# EAGLE design M5_STACK_STAMP_C3_ISOBUS_JSTex (EAGLE 9.6.2)
Assembly variants: Inline
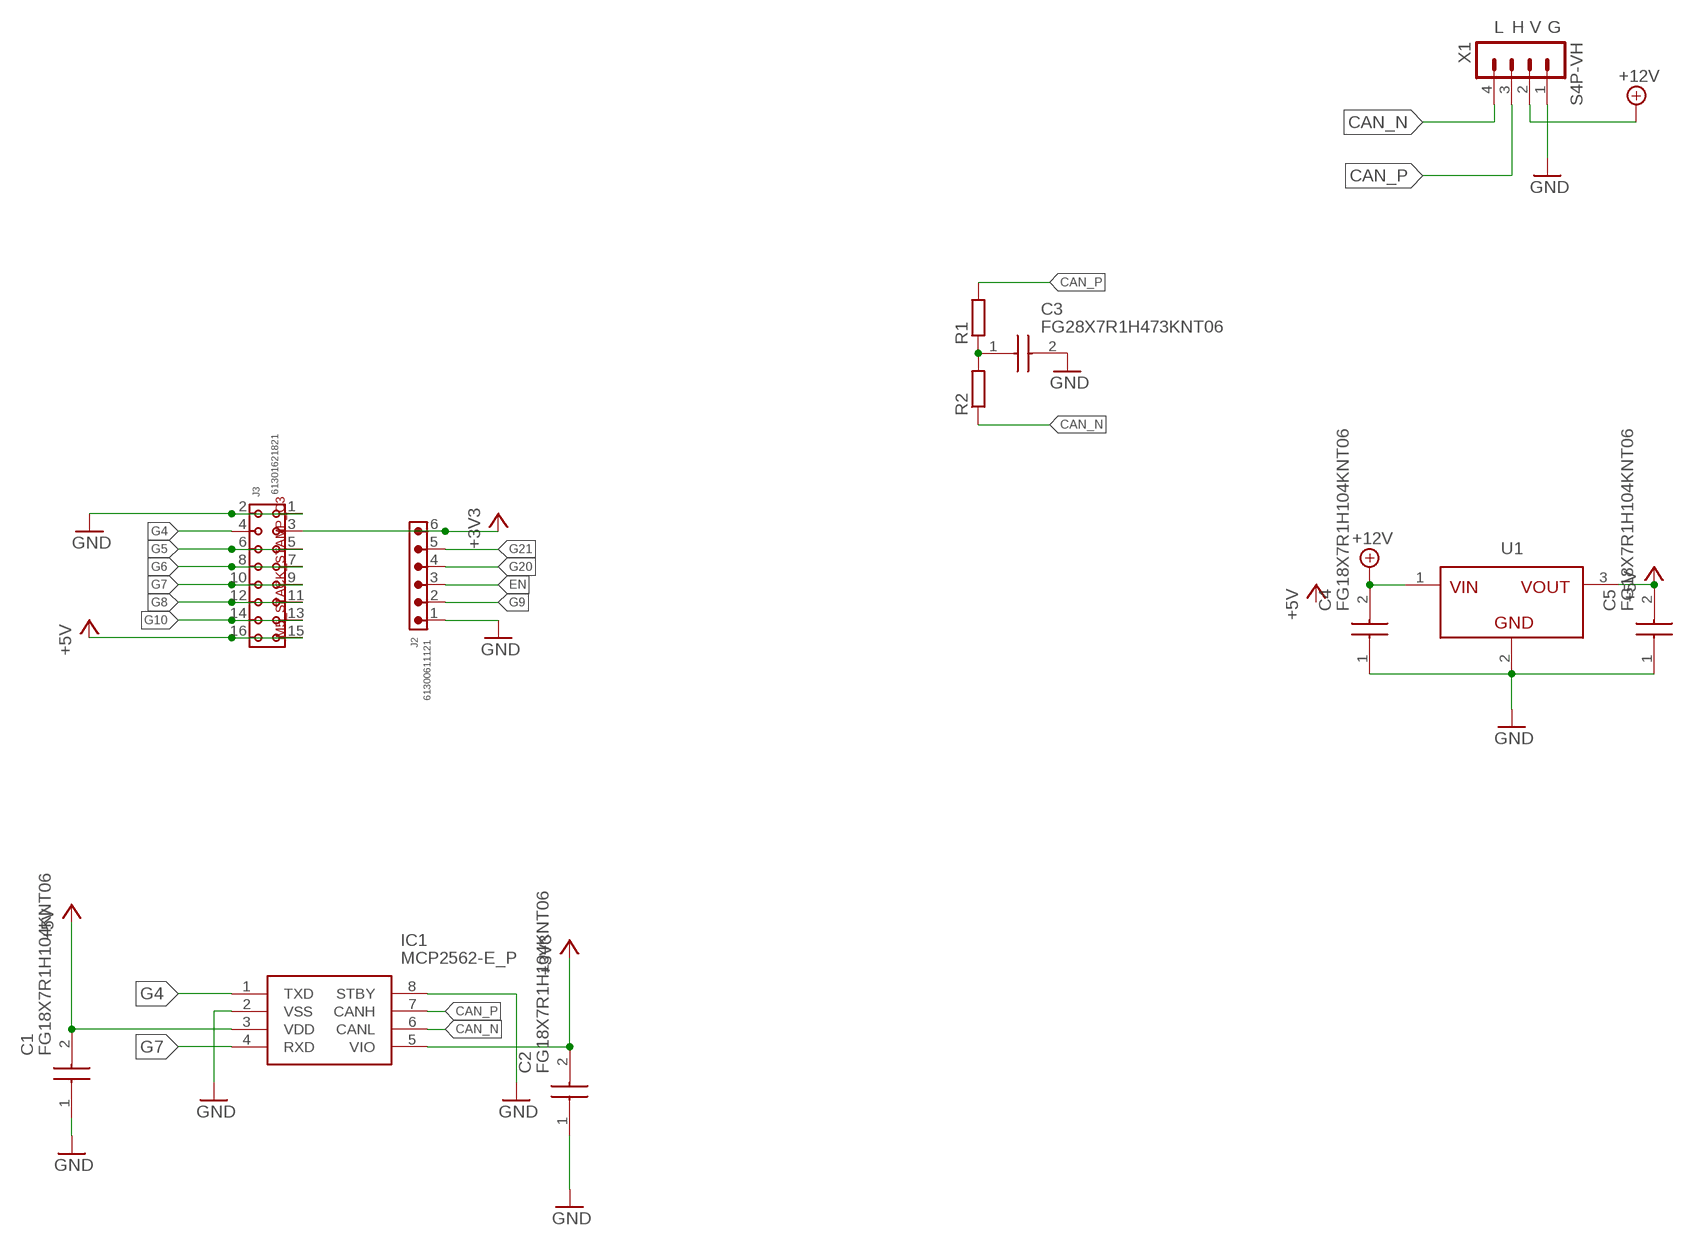
[diagram p0: schematic, sheet 1]

## Parts
C1  FG18X7R1H104KNT06  [FG18C0G1H101JNT06]
C2  FG18X7R1H104KNT06  [FG18C0G1H101JNT06]
C3  FG28X7R1H473KNT06  [FG28]
C4  FG18X7R1H104KNT06  [FG18C0G1H101JNT06]
C5  FG18X7R1H104KNT06  [FG18C0G1H101JNT06]
IC1  MCP2562-E_P  [DIP781W56P254L950H533Q8N]
J2  61300611121  6130XX11121_61300611121  [61300611121]
J3  61301621821  6130XX21821_61301621821  [61301621821]
R1  R-EU_0204/7  [0204/7]
R2  R-EU_0204/7  [0204/7]
U1  MAGI³C-FDSM_SIP-3_173010542_173XXXX42  [MAGI³C-FDSM_173XXXX42]
U$1  M5_STACK_STAMP_C3  [M5_STACK_STAMP_C3]
X1  S4P-VH  [S4P-VH]

## Nets
+3V3: C2.2 IC1.5(VIO) J2.6 J3.3
+5V: C1.2 C5.2 IC1.3(VDD) J3.15 J3.16 U1.3(VOUT)
+12V: C4.2 U1.1(VIN) X1.2
CAN_N: IC1.6(CANL) R2.1 X1.4
CAN_P: IC1.7(CANH) R1.2 X1.3
EN: J2.3
G4: IC1.1(TXD) J3.4
G5: J3.5 J3.6
G6: J3.7 J3.8
G7: IC1.4(RXD) J3.9 J3.10
G8: J3.11 J3.12
G9: J2.2
G10: J3.13 J3.14
G20: J2.4
G21: J2.5
GND: C1.1 C2.1 C3.2 C4.1 C5.1 IC1.2(VSS) IC1.8(STBY) J2.1 J3.1 J3.2 U1.2(GND) X1.1
N$1: C3.1 R1.1 R2.2

## Notes on the sheet
- L | H | V | G

## Library data of the parts
C1 C2 C4 C5 = FG18X7R1H104KNT06-pcb-part-libraries:FG18X7R1H104KNT06: Multilayer Ceramic Capacitors MLCC - Leaded RAD 50V 0.1uF X7R 10% LS:2.5mm Source: Datasheet <https://product.tdk.com/en/system/files?file=dam/doc/product/capacitor/ceramic/lead-mlcc/catalog/leadmlcc_halogenfree_fg_en.pdf>; DESCRIPTION: Multilayer Ceramic Capacitors MLCC - Leaded RAD 50V 0.1uF X7R 10% LS:2.5mm; HEIGHT: 5.5mm; MANUFACTURER_NAME: TDK; MANUFACTURER_PART_NUMBER: FG18X7R1H104KNT06; MOUSER_PART_NUMBER: 810-FG18X7R1H104KNT6; MOUSER_PRICE-STOCK: https://www.mouser.co.uk/ProductDetail/TDK/FG18X7R1H104KNT06?qs=qf2ddTMq67WA8sH6FratLA%3D%3D
C3 = FG28X7R1H473KNT06-pcb-part-libraries:FG28X7R1H473KNT06: MLCC with dipped radial lead Source: Datasheet <https://componentsearchengine.com/Datasheets/1/FG28X7R1H473KNT06.pdf>; DESCRIPTION: MLCC with dipped radial lead; HEIGHT: 5.5mm; MANUFACTURER_NAME: TDK; MANUFACTURER_PART_NUMBER: FG28X7R1H473KNT06; MOUSER_PART_NUMBER: 810-FG28X7R1H473KNT6; MOUSER_PRICE-STOCK: https://www.mouser.com/Search/Refine.aspx?Keyword=810-FG28X7R1H473KNT6
IC1 = MCP2562-E_P-pcb-part-libraries:MCP2562-E_P: CAN Transceiver 1Mbps 5V 125degC PDIP8 Microchip MCP2562-E/P, CAN Transceiver 1-channel IEC 61000-4-2, 8-Pin PDIP Source: Datasheet <https://datasheet.datasheetarchive.com/originals/distributors/Datasheets-DGA14/1194231.pdf>; DESCRIPTION: CAN Transceiver 1Mbps 5V 125degC PDIP8 Microchip MCP2562-E/P, CAN Transceiver 1-channel IEC 61000-4-2, 8-Pin PDIP; HEIGHT: 5.334mm; MANUFACTURER_NAME: Microchip; MANUFACTURER_PART_NUMBER: MCP2562-E/P; MOUSER_PART_NUMBER: 579-MCP2562-E/P; MOUSER_PRICE-STOCK: https://www.mouser.co.uk/ProductDetail/Microchip-Technology/MCP2562-E-P?qs=6qKXPk0vzx1U%252B0h82Z%2Fybg%3D%3D
J2 = Wurth_Connectors_WR-PHD:6130XX11121_61300611121: WR-PHD 2.54 mm THT Pin Header ARTICLE PROPERTIES: Pins:1;​ 2;​ 3;​ 4;​ 5;​ 6;​ 7;​ 8;​ 9;​ 10;​ 12;​ 13;​ 14;​ 15;​ 16;​ 18;​ 20;​ 22;​ 24;​ 25;​ 32;​ 36;​ 40 KIND PROPERTIES: Pitch：2.54 mm Quality Class:3 as per CECC 75 301-802 Rows：Single Gender：Pin Header Type：Straight MATERIAL PROPERTIES: Insulator Material :PBT Insulator Flammability Rating:UL94 V-0 Contact Material:Copper Alloy Contact Plating:Gold Contact Type:Stamped GENERAL INFORMATION Operating Temperature:-40 up to +105 °C Compliance:RoHS ELECTRICAL PROPERTIES: Rated Current:3 A IR 1:3 A Withstanding Voltage:500 V (AC) Contact Resistance:20 mΩ RISO:1000 MΩ CERTIFICATION UL Approval:E323964 PACKAGING PROPERTIES Packaging:Bag <https://katalog.we-online.com/media/images/v2/o33211v209%20Family_BTB_PHD_6130xx11121.jpg> Details see: https://katalog.we-online.com/en/em/PHD_2_54_THT_PIN_HEADER_6130XX11121 Updated by Yingchun,Shan 2019-10-16 2019 (C) Würth Elektronik; DATASHEET-URL: https://www.we-online.com/catalog/datasheet/61300611121.pdf; GENDER: Pin Header; IR: 3A; MOUNT: THT; PACKAGING: Bag; PART-NUMBER: 61300611121; PINS: 6; PITCH: 2.54mm; ROWS: Single; TYPE: Straight
J3 = Wurth_Connectors_WR-PHD:6130XX21821_61301621821: WR-PHD 2.54 mm Dual Socket Header ARTICLE PROPERTIES: Pins:4;​ 6;​ 8;​ 10;​ 12;​ 14;​ 16;​ 18;​ 20;​ 22;​ 24;​ 26;​ 28;​ 30;​ 32;​ 34;​ 36;​ 40;​ 44;​ 64;​ 72 KIND PROPERTIES: Pitch：2.54 mm Quality Class:3 as per CECC 75 301-802 Rows：Dual Gender：Socket Header Type：Straight MATERIAL PROPERTIES: Insulator Material :PBT Insulator Flammability Rating:UL94 V-0 Contact Material:Copper Alloy Contact Plating:Gold Contact Type:Stamped GENERAL INFORMATION Operating Temperature:-40 up to +125 °C Compliance:Lead free / RoHS ELECTRICAL PROPERTIES: Rated Current:3 A IR 1:3 A Withstanding Voltage:500 V (AC) Contact Resistance:20 mΩ RISO:1000 MΩ CERTIFICATION UL Approval:E323964 PACKAGING PROPERTIES Packaging:Tray <https://katalog.we-online.com/media/images/v2/o57948v209%20Family_Dual_Socket_Header_WR-PHD_6130xx21821.jpg> Details see: https://katalog.we-online.com/en/em/PHD_2_54_DUAL_SOCKET_HEADER_6130XX21821 Updated by Yingchun,Shan 2019-10-21 2019 (C) Würth Elektronik; DATASHEET-URL: https://www.we-online.com/catalog/datasheet/61301621821.pdf; GENDER: Socket Header; IR: 3A; MOUNT: THT; PACKAGING: Tray; PART-NUMBER: 61301621821; PINS: 16; PITCH: 2.54mm; ROWS: Dual; TYPE: Straight
R1 R2 = resistor:R-EU_: RESISTOR, European symbol
U1 = Wurth_Step Down Converter_MagI³C-FDSM:MAGI³C-FDSM_SIP-3: MagI³C-FDSM Fixed Step Down Regulator Module Characteristics Simplest design (no power supply knowledge required) Leaded through-hole package for easy manufacturing and prototyping Stand alone solution (CIN and COUT integrated, no external components) L78x series linear regulator replacement (no heatsink required) Low conducted and radiated EMI (compliant to EN55022 class B) Applications Point-of-Load from 24V, 18V, 15V, 12V, 9V rail Replacement for linear regulators Interface and microcontroller supply Industrial, Test & Measurement, Medical applications System power supplies <https://katalog.we-online.com/media/images/v2/o55808v209%20FDSM_MagI3C_173010378_4C.jpg> Details see: https://www.we-online.de/katalog/en/MAGIC_FDSM_FIXED_OUTPUT_VOLTAGE/ Updated by Ella Wu 2020-03-17 2020 (C) Würth Elektronik; DATASHEET-URL: https://www.we-online.de/katalog/datasheet/173010542.pdf; I-OUTPUT: 1A; MOUNT: THT; PART-NUMBER: 173010542; V-INPUT: 8-42V; V-OUTPUT: 5V
U$1 = M5_STACK_STAMP_C3:M5_STACK_STAMP_C3
X1 = con-JST VH:S4P-VH: JST VH Series header 3.96mm pitch disconnectable crimp style connectors, horizontal (side entry type), 4 pins

## Net classes
1 GND: width 0.127 mm, clearance 0.127 mm to class 0

## Board
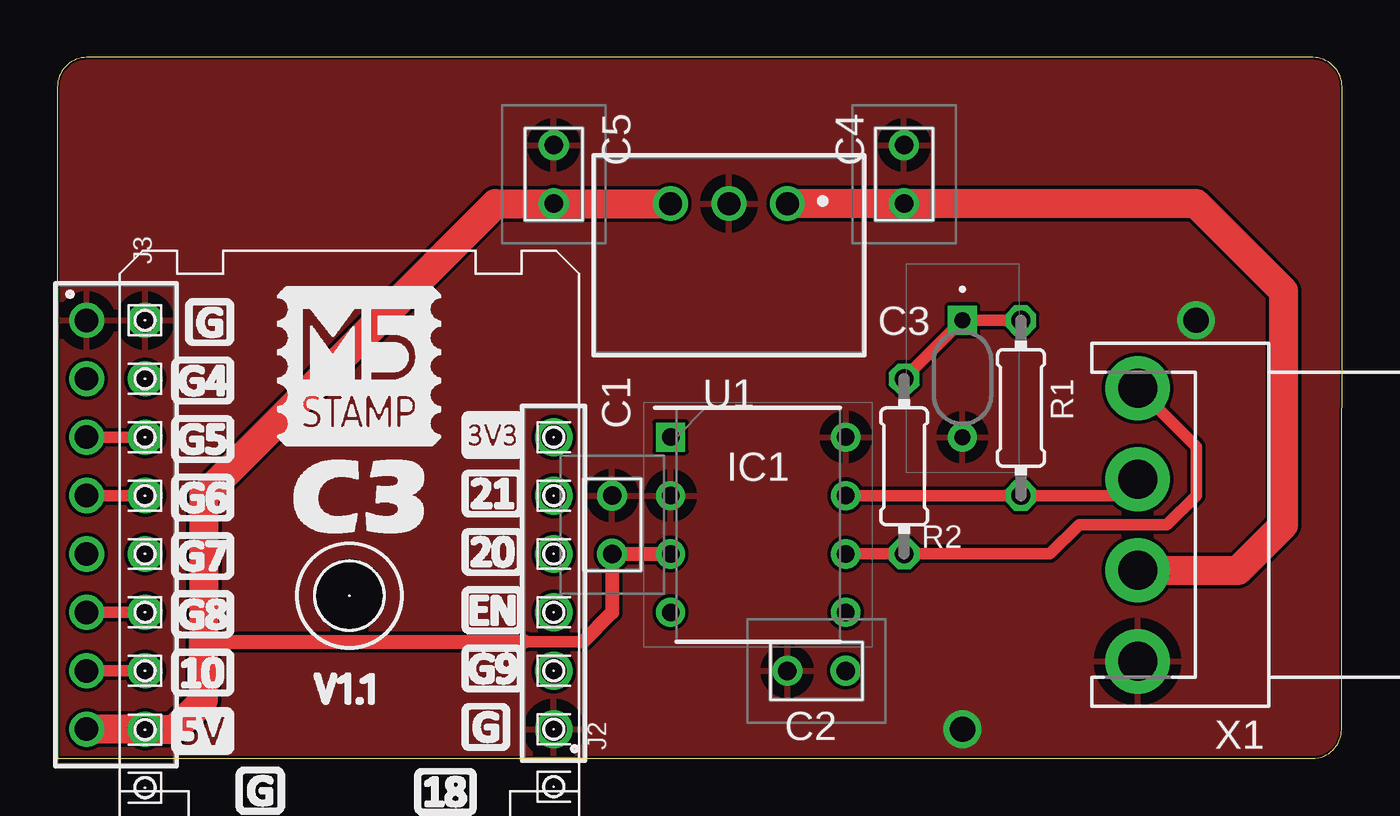
[diagram p1: board, top side]
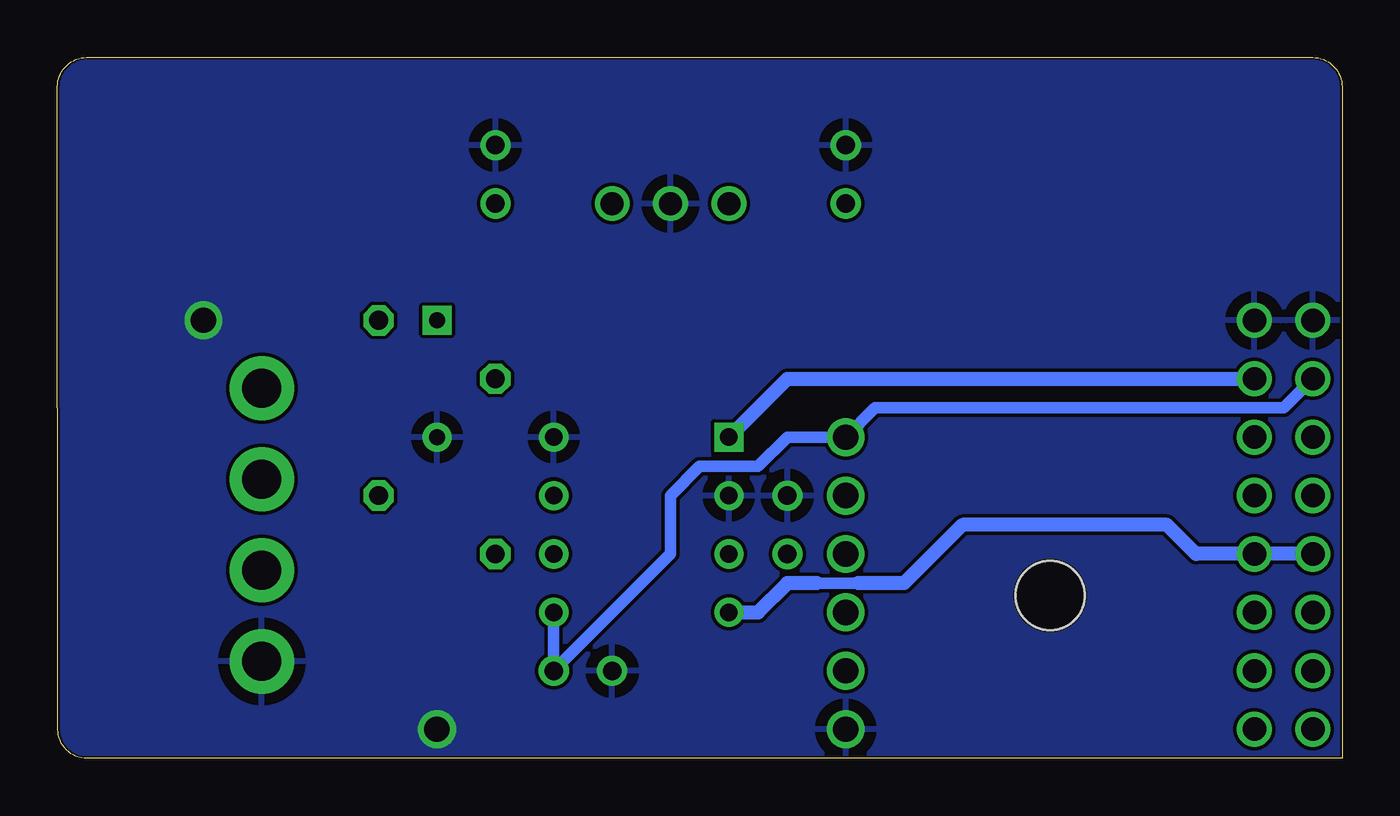
[diagram p2: board, bottom side, seen from below]

Size 55.88 x 30.48 mm. Coordinates in mm from the lower left corner, seen from the top.
Outline: 0,0 54.59,0 arc90 55.86,1.27 55.88,29.21 arc90 54.61,30.48 1.27,30.48 arc90 0,29.21 0,0
Copper layers (1*16): Top 0.035mm / dielectric 1.5mm / Bottom 0.035mm
Design rules "default *": minimum track width 6mil, minimum drill 0.35mm, track to track 6mil, track to pad 6mil, pad to pad 6mil, via to via 6mil, smd to smd 6mil, copper to edge 4mil, drill to drill 6mil, minimum pad ring 10mil, minimum via ring 8mil, stop-mask expansion 4mil, vias tented up to drill 0mil, thermal gap 20mil

### Footprints (pad centres in the part's own frame; a part is rotated, then mirrored left to right if it is on the bottom)
FG18C0G1H101JNT06 = drill 0.8 pad 1.3: 1 -1.27,0; 2 1.27,0
FG28 = drill 0.7 pad 1.25 square: 1 0,0 | drill 0.7 pad 1.25: 2 5.08,0
DIP781W56P254L950H533Q8N = drill 0.759 pad 1.159 square: 1 -3.81,3.81 | drill 0.759 pad 1.159: 2 -3.81,1.27; 3 -3.81,-1.27; 4 -3.81,-3.81; 5 3.81,-3.81; 6 3.81,-1.27; 7 3.81,1.27; 8 3.81,3.81
61300611121 = drill 1.1: 1 -6.35,0; 2 -3.81,0; 3 -1.27,0; 4 1.27,0; 5 3.81,0; 6 6.35,0
61301621821 = drill 1.02: 1 -8.89,-1.27; 2 -8.89,1.27; 3 -6.35,-1.27; 4 -6.35,1.27; 5 -3.81,-1.27; 6 -3.81,1.27; 7 -1.27,-1.27; 8 -1.27,1.27; 9 1.27,-1.27; 10 1.27,1.27; 11 3.81,-1.27; 12 3.81,1.27; 13 6.35,-1.27; 14 6.35,1.27; 15 8.89,-1.27; 16 8.89,1.27
0204/7 = drill 0.813 octagon: 1 -3.81,0; 2 3.81,0
MAGI³C-FDSM_173XXXX42 = drill 1: 1 -2.54,0; 2 0,0; 3 2.54,0
M5_STACK_STAMP_C3 = hole 3: 8.89,-11.97
S4P-VH = drill 1.7 pad 2.794: 1 -5.94,0; 2 -1.98,0; 3 1.98,0; 4 5.94,0

### Placement (x,y rotation side)
C1  24.13,10.16 270 top
C2  33.02,3.81 0 top
C3  39.37,19.05 270 top
C4  36.83,25.4 270 top
C5  21.59,25.4 270 top
IC1  30.48,10.16 0 top
J2  21.59,7.62 90 top
J3  2.54,10.16 270 top
R1  41.91,15.24 270 top
R2  36.83,12.7 90 top
U1  29.21,24.13 180 top
U$1  3.81,19.05 0 top
X1  46.99,10.16 90 top

### Tracks (layer width: path | path; a pad name or v marks a point on that pad's centre or on a via)
+3V3
  Bottom 0.508: IC1.5 C2.2 29.21,8.89 29.21,11.43 27.94,12.7 25.4,12.7 24.13,13.97 J2.6 20.32,15.24 2.54,15.24 J3.3
+5V
  Top 0.508: 20.32,5.08 22.86,5.08
  Top 0.61: IC1.3 C1.2 24.13,6.35 22.86,5.08 | 6.35,5.08 20.32,5.08
  Top 1.27: U1.3 C5.2 19.05,24.13 6.35,11.43 6.35,5.08 6.35,2.54 5.08,1.27 J3.16 J3.15
+12V
  Top 1.27: U1.1 C4.2 49.53,24.13 53.34,20.32 53.34,10.16 51.36,8.18 X1.2
CAN_N
  Top 0.508: IC1.6 R2.1 43.18,8.89 44.45,10.16 48.26,10.16 49.53,11.43 49.53,13.56 X1.4
CAN_P
  Top 0.508: IC1.7 R1.2 46.28,11.43 X1.3
G4
  Bottom 0.61: IC1.1 24.13,16.51 J3.4
G5
  Top 0.508: J3.6 J3.5
G6
  Top 0.508: J3.7 J3.8
G7
  Bottom 0.508: 21.05,7.62 22.86,7.62
  Bottom 0.61: J3.9 J3.10 6.35,8.89 7.62,10.16 16.51,10.16 19.05,7.62 21.05,7.62 | IC1.4 25.4,6.35 24.13,7.62 22.86,7.62
G8
  Top 0.508: J3.12 J3.11
G10
  Top 0.508: J3.14 J3.13
GND  (via drill 1.1)
  other vias: 39.37,1.27 49.53,19.05
  pour Top: -1.27,31.75 57.15,31.75 57.15,-3.81 -1.27,-3.81
  pour Bottom: -1.27,31.75 57.15,31.75 57.15,-3.81 -1.27,-3.81
N$1
  Top 0.508: R1.1 C3.1 R2.2